# Altium schematic sheet Plumo-2D.SchDoc
size C; CompanyName: Afero; DrawnBy: SR/RSB; Organization: Afero, Inc.; Revision: PVT
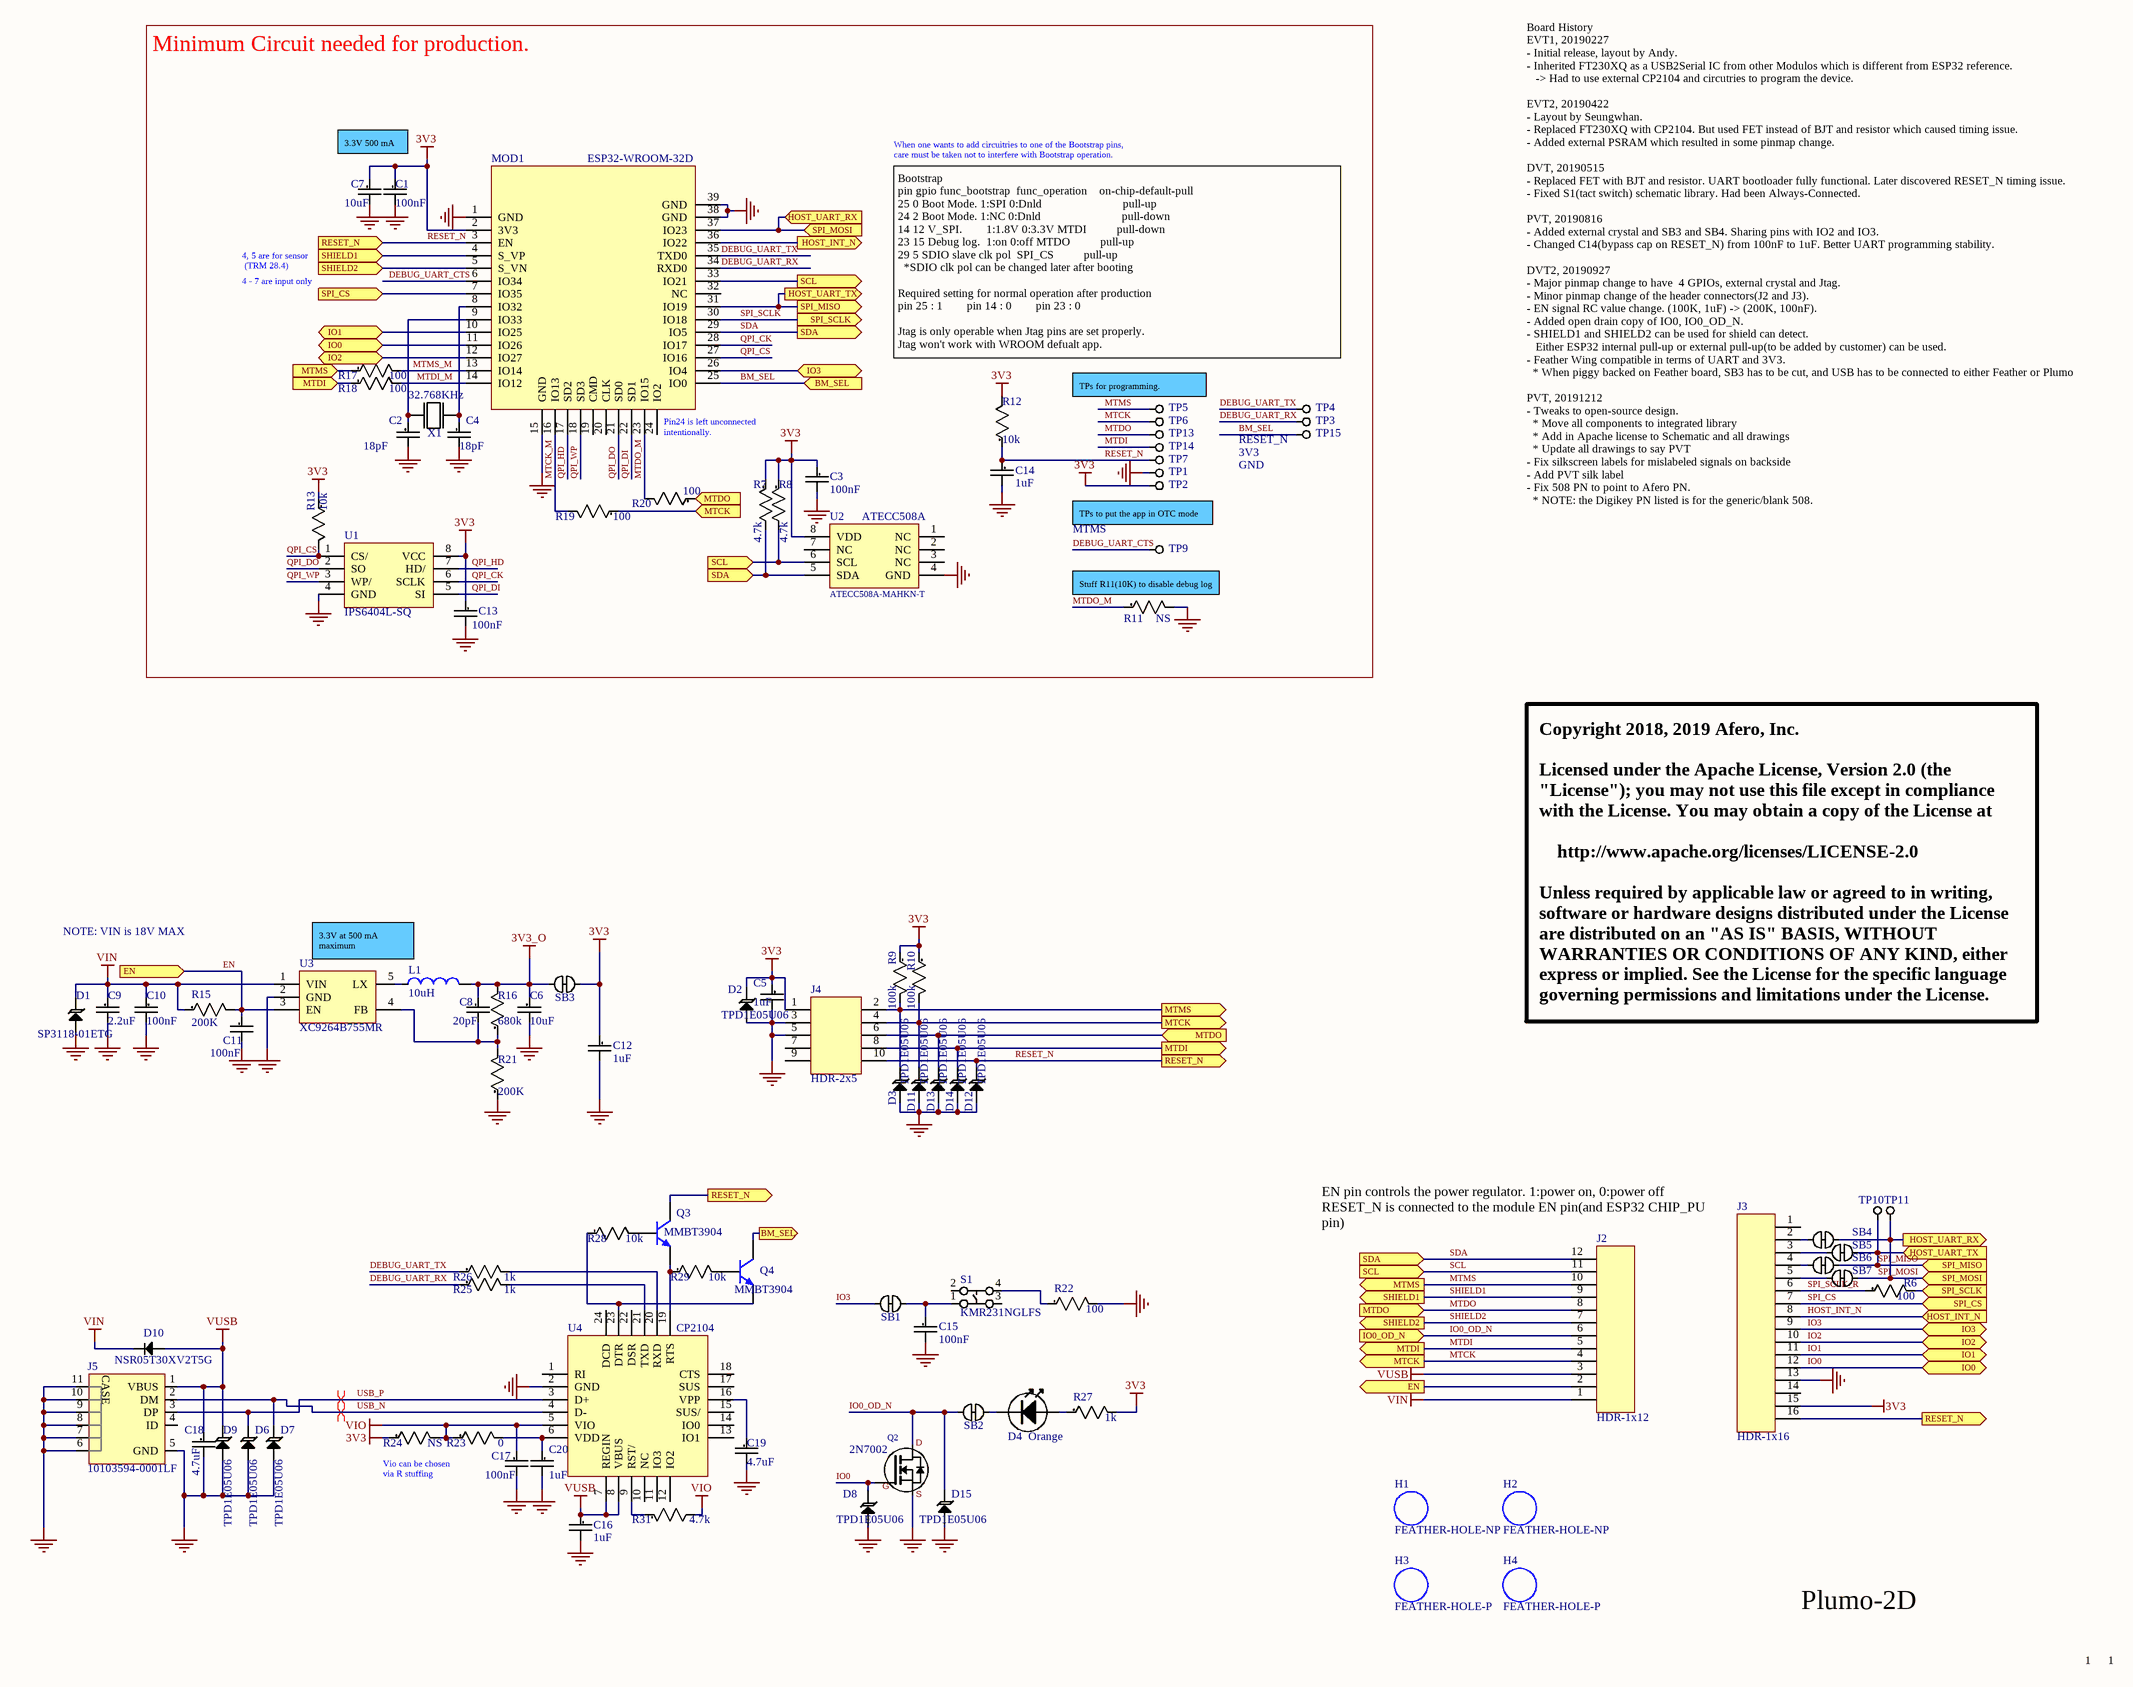
[diagram p0: Plumo-2D.SchDoc]

## Parts
C1  100nF  [0402C-GENERIC]
C2  18pF  [0402C-GENERIC]
C3  100nF  [0402C-GENERIC]
C4  18pF  [0402C-GENERIC]
C5  1uF  [0402C-GENERIC]
C6  10uF  [0603C-GENERIC]
C7  10uF  [0603C-GENERIC]
C8  20pF  [0402C-GENERIC]
C9  2.2uF  [0603C-GENERIC]
C10  100nF  [0402C-GENERIC]
C11  100nF  [0402C-GENERIC]
C12  1uF  [0402C-GENERIC]
C13  100nF  [0402C-GENERIC]
C14  1uF  [0402C-GENERIC]
C15  100nF  [0402C-GENERIC]
C16  1uF  [0402C-GENERIC]
C17  100nF  [0402C-GENERIC]
C18  4.7uF  [0603C-GENERIC]
C19  4.7uF  [0603C-GENERIC]
C20  1uF  [0402C-GENERIC]
D1  SP3118-01ETG  [SOD882]
D2  TPD1E05U06  [SON70P100X45-2N]
D3  TPD1E05U06  [SON70P100X45-2N]
D4  Orange  [0603LED]
D6  TPD1E05U06  [SON70P100X45-2N]
D7  TPD1E05U06  [SON70P100X45-2N]
D8  TPD1E05U06  [SON70P100X45-2N]
D9  TPD1E05U06  [SON70P100X45-2N]
D10  NSR05T30XV2T5G  [SOD-523]
D11  TPD1E05U06  [SON70P100X45-2N]
D12  TPD1E05U06  [SON70P100X45-2N]
D13  TPD1E05U06  [SON70P100X45-2N]
D14  TPD1E05U06  [SON70P100X45-2N]
D15  TPD1E05U06  [SON70P100X45-2N]
H1  FEATHER-HOLE-NP  [FEATHER-HOLE-NP]  (no BOM)
H2  FEATHER-HOLE-NP  [FEATHER-HOLE-NP]  (no BOM)
H3  FEATHER-HOLE-P  [FEATHER-HOLE-P]  (no BOM)
H4  FEATHER-HOLE-P  [FEATHER-HOLE-P]  (no BOM)
J2  HDR-1x12  [HDR-1X12]
J3  HDR-1x16  [HDR-1X16]
J4  HDR-2x5  [S9015E-05]
J5  10103594-0001LF  [10103594-0001LF]
L1  10uH  [ASPI-0315FS]
MOD1  ESP32-WROOM-32D  [ESP32-WROOM-32D]
Q2  2N7002  [SOT23]
Q3  MMBT3904  [sot23]
Q4  MMBT3904  [sot23]
R6  100  [0402R-GENERIC]
R7  4.7k  [0402R-GENERIC]
R8  4.7k  [0402R-GENERIC]
R9  100k  [0402R-GENERIC]
R10  100k  [0402R-GENERIC]
R11  NS  [0402R-GENERIC]  (no BOM)
R12  10k  [0402R-GENERIC]
R13  10k  [0402R-GENERIC]
R15  200K  [0402R-GENERIC]
R16  680k  [0402R-GENERIC]
R17  100  [0402R-GENERIC]
R18  100  [0402R-GENERIC]
R19  100  [0402R-GENERIC]
R20  100  [0402R-GENERIC]
R21  200K  [0402R-GENERIC]
R22  100  [0402R-GENERIC]
R23  0  [0402R-GENERIC]
R24  NS  [0402R-GENERIC]  (no BOM)
R25  1k  [0402R-GENERIC]
R26  1k  [0402R-GENERIC]
R27  1k  [0402R-GENERIC]
R28  10k  [0402R-GENERIC]
R29  10k  [0402R-GENERIC]
R31  4.7k  [0402R-GENERIC]
S1  KMR231NGLFS  [KMR231NGLFS]
SB1  Solderbridge  [SBNC]  (value not drawn)  (net tie, no BOM)
SB2  Solderbridge  [SBNC]  (value not drawn)  (net tie, no BOM)
SB3  Solderbridge  [SBNC]  (value not drawn)  (net tie, no BOM)
SB4  Solderbridge  [SBNC]  (value not drawn)  (net tie, no BOM)
SB5  Solderbridge  [SBNC]  (value not drawn)  (net tie, no BOM)
SB6  Solderbridge  [SBNC]  (value not drawn)  (net tie, no BOM)
SB7  Solderbridge  [SBNC]  (value not drawn)  (net tie, no BOM)
TP1  TP1MM  [TP1MM]  (value not drawn)  (no BOM)
TP2  TP1MM  [TP1MM]  (value not drawn)  (no BOM)
TP3  TP1MM  [TP1MM]  (value not drawn)  (no BOM)
TP4  TP1MM  [TP1MM]  (value not drawn)  (no BOM)
TP5  TP1MM  [TP1MM]  (value not drawn)  (no BOM)
TP6  TP1MM  [TP1MM]  (value not drawn)  (no BOM)
TP7  TP1MM  [TP1MM]  (value not drawn)  (no BOM)
TP9  TP1MM  [TP1MM]  (value not drawn)  (no BOM)
TP10  TP1MM  [TP1MM]  (value not drawn)  (no BOM)
TP11  TP1MM  [TP1MM]  (value not drawn)  (no BOM)
TP13  TP1MM  [TP1MM]  (value not drawn)  (no BOM)
TP14  TP1MM  [TP1MM]  (value not drawn)  (no BOM)
TP15  TP1MM  [TP1MM]  (value not drawn)  (no BOM)
U1  IPS6404L-SQ  [IPUS.PSRAM]
U2  ATECC508A  Manufacturer Part Number: ATECC508A-MAHKN-T  [SON50P300X60-8N]
U3  XC9264B755MR  [SOT95P275X130-5N]
U4  CP2104  [CP2104]
X1  32.768KHz  [ABS06]

## Blocks framed on the sheet
Minimum Circuit needed for production.: C1-C4 C7 C13 C14 MOD1 R7 R8 R11-R13 R17-R20 TP1-TP7 TP9 TP13-TP15 U1 U2 X1

## Ports
BM_SEL, EN, HOST_INT_N, HOST_UART_RX, HOST_UART_TX, IO0 (bidir), IO0_OD_N, IO1 (bidir), IO2 (bidir), IO3 (bidir), MTCK, MTDI, MTDO, MTMS, RESET_N, SCL, SDA, SHIELD1, SHIELD2, SPI_CS, SPI_MISO, SPI_MOSI, SPI_SCLK (in), SPI_SCLK (out)

## Nets
3V3: C1.1 C3.1 C5.1 C7.1 C12.1 C13.1 D2.1(I/O) J3.15 J4.1 MOD1.2(3V3) R7.1 R8.1 R9.1 R10.1 R12.2 R13.1 R24.1 R27.2 SB3.1 TP2.1 U1.8(VCC) U2.8(VDD)
3V3_O: C6.1 C8.1 L1.2 R16.2 SB3.2
GND: C1.2 C2.2 C3.2 C4.2 C5.2 C6.2 C7.2 C9.2 C10.2 C11.2 C12.2 C13.2 C14.2 C15.2 C16.2 C17.2 C18.2 C19.2 C20.2 D1.2(GND) D2.2(GND) D3.2(GND) D6.2(GND) D7.2(GND) D8.2(GND) D9.2(GND) D11.2(GND) D12.2(GND) D13.2(GND) D14.2(GND) D15.2(GND) J3.13 J4.3 J4.5 J5.5(GND) J5.6(CASE) J5.7(CASE) J5.8(CASE) J5.9(CASE) J5.10(CASE) J5.11(CASE) MOD1.1(GND) MOD1.15(GND) MOD1.38(GND) MOD1.39(GND) Q2.2(S) R11.2 R21.1 R22.2 TP1.1 U1.4(GND) U2.4(GND) U3.2(GND) U4.2(GND)
VIN: C9.1 C10.1 D1.1(I/O) D10.1(I/O) J2.1 R15.1 U3.1(VIN)
VIO: C17.1 R23.1 R24.2 R31.2 U4.5(VIO)
VUSB: C16.1 C18.1 D9.1(I/O) D10.2(GND) J2.3 J5.1(VBUS) U4.7(REGIN) U4.8(VBUS)
BM_SEL: MOD1.25(IO0) Q4.3(C) TP15.1 ; port BM_SEL
DEBUG_UART_CTS: MOD1.6(IO34) TP9.1
DEBUG_UART_RX: MOD1.34(RXD0) R25.1 TP3.1
DEBUG_UART_TX: MOD1.35(TXD0) R26.1 TP4.1
EN: C11.1 J2.2 R15.2 U3.3(EN) ; port EN
HOST_INT_N: J3.8 MOD1.36(IO22) ; port HOST_INT_N
IO0: D8.1(I/O) J3.12 MOD1.11(IO26) Q2.1(G) ; port IO0
IO0_OD_N: D15.1(I/O) J2.6 Q2.3(D) SB2.1 ; port IO0_OD_N
IO1: J3.11 MOD1.10(IO25) ; port IO1
IO2: J3.10 MOD1.12(IO27) ; port IO2
IO3: J3.9 MOD1.26(IO4) SB1.1 ; port IO3
MTCK: D11.1(I/O) J2.4 J4.4 R10.2 R19.1 TP6.1 ; port MTCK
MTCK_M: MOD1.16(IO13) R19.2
MTDI: D14.1(I/O) J2.5 J4.8 R18.1 TP14.1 ; port MTDI
MTDI_M: MOD1.14(IO12) R18.2
MTDO: D13.1(I/O) J2.8 J4.6 R20.1 TP13.1 ; port MTDO
MTDO_M: MOD1.23(IO15) R11.1 R20.2
MTMS: D3.1(I/O) J2.10 J4.2 R9.2 R17.1 TP5.1 ; port MTMS
MTMS_M: MOD1.13(IO14) R17.2
QPI_CK: MOD1.28(IO17) U1.6(SCLK)
QPI_CS: MOD1.27(IO16) R13.2 U1.1(CS/)
QPI_DI: MOD1.22(SD1) U1.5(SI)
QPI_DO: MOD1.21(SD0) U1.2(SO)
QPI_HD: MOD1.17(SD2) U1.7(HD/)
QPI_WP: MOD1.18(SD3) U1.3(WP/)
RESET_N: C14.1 D12.1(I/O) J3.16 J4.10 MOD1.3(EN) Q3.3(C) R12.1 TP7.1 ; port RESET_N
SCL: J2.11 MOD1.33(IO21) R8.2 U2.6(SCL) ; port SCL
SDA: J2.12 MOD1.29(IO5) R7.2 U2.5(SDA) ; port SDA
SHIELD1: J2.9 MOD1.4(S_VP) ; port SHIELD1
SHIELD2: J2.7 MOD1.5(S_VN) ; port SHIELD2
SPI_CS: J3.7 MOD1.7(IO35) ; port SPI_CS
SPI_MISO: MOD1.31(IO19) SB5.2 SB6.2 TP10.1 ; port SPI_MISO, port HOST_UART_TX
SPI_MOSI: MOD1.37(IO23) SB4.2 SB7.2 TP11.1 ; port SPI_MOSI, port HOST_UART_RX
SPI_SCLK: MOD1.30(IO18) R6.2 ; port SPI_SCLK
SPI_SCLK_R: J3.6 R6.1
USB_N: D7.1(I/O) J5.2(DM) U4.4(D-)
USB_P: D6.1(I/O) J5.3(DP) U4.3(D+)
NetC2_1: C2.1 MOD1.9(IO33) X1.2
NetC4_1: C4.1 MOD1.8(IO32) X1.1
NetC8_2: C8.2 R16.1 R21.2 U3.4(FB)
NetC15_1: C15.1 S1.1 SB1.2
NetC19_1: C19.1 U4.16(VPP)
NetC20_1: C20.1 R23.2 U4.6(VDD)
NetD4_A: D4.A R27.1
NetD4_K: D4.K SB2.2
NetJ3_2: J3.2 SB4.1
NetJ3_3: J3.3 SB5.1
NetJ3_4: J3.4 SB6.1
NetJ3_5: J3.5 SB7.1
NetL1_1: L1.1 U3.5(LX)
NetQ3_1: Q3.1(B) R28.2
NetQ3_2: Q3.2(E) R29.1 U4.19(RTS)
NetQ4_1: Q4.1(B) R29.2
NetQ4_2: Q4.2(E) R28.1 U4.23(DTR)
NetR22_1: R22.1 S1.4
NetR25_2: R25.2 U4.21(TXD)
NetR26_2: R26.2 U4.20(RXD)
NetR31_1: R31.1 U4.9(RST/)

Not connected (* = marked no-connect by the designer): J3 1 14; J4 7 9; J5 4(ID); MOD1 19(CMD) 20(CLK) 24(IO2) 32(NC); S1 2 3; U2 1(NC) 2(NC) 3(NC) 7(NC); U4 1(RI) 10(NC) 11(IO3) 12(IO2) 13(IO1) 14(IO0) 15(SUS/) 17(SUS) 18(CTS) 22(DSR) 24(DCD)

## Layout directives
differential pair: USB_N, USB_P

## Notes on the sheet
- 3.3V 500 mA
- When one wants to add circuitries to one of the Bootstrap pins,
  care must be taken not to interfere with Bootstrap operation.
- 4, 5 are for sensor
  (TRM 28.4)
- 4 - 7 are input only
- Bootstrap
  pin	gpio	func_bootstrap		func_operation    on-chip-default-pull
  25	0	Boot Mode. 1:SPI 0:Dnld	                          pull-up
  24	2	Boot Mode. 1:NC 0:Dnld	                          pull-down
  14	12	V_SPI.        1:1.8V 0:3.3V	MTDI	         pull-down
  23	15	Debug log.  1:on 0:off	MTDO	         pull-up
  29	5	SDIO slave clk pol		SPI_CS	         pull-up
  *SDIO clk pol can be changed later after booting
  Required setting for normal operation after production
  pin 25 : 1        pin 14 : 0        pin 23 : 0
  Jtag is only operable when Jtag pins are set properly.
  Jtag won't work with WROOM defualt app.
- (near TP5) TPs for programming.
- (near MOD1) Pin24 is left unconnected intentionally.
- RESET_N
- 3V3
- GND
- TPs to put the app in OTC mode
- MTMS
- Stuff R11(10K) to disable debug log
- Board History
  EVT1, 20190227
  - Initial release, layout by Andy.
  - Inherited FT230XQ as a USB2Serial IC from other Modulos which is different from ESP32 reference.
  -> Had to use external CP2104 and circutries to program the device.
  EVT2, 20190422
  - Layout by Seungwhan.
  - Replaced FT230XQ with CP2104. But used FET instead of BJT and resistor which caused timing issue.
  - Added external PSRAM which resulted in some pinmap change.
  DVT, 20190515
  - Replaced FET with BJT and resistor. UART bootloader fully functional. Later discovered RESET_N timing issue.
  - Fixed S1(tact switch) schematic library. Had been Always-Connected.
  PVT, 20190816
  - Added external crystal and SB3 and SB4. Sharing pins with IO2 and IO3.
  - Changed C14(bypass cap on RESET_N) from 100nF to 1uF. Better UART programming stability.
  DVT2, 20190927
  - Major pinmap change to have  4 GPIOs, external crystal and Jtag.
  - Minor pinmap change of the header connectors(J2 and J3).
  - EN signal RC value change. (100K, 1uF) -> (200K, 100nF).
  - Added open drain copy of IO0, IO0_OD_N.
  - SHIELD1 and SHIELD2 can be used for shield can detect.
  Either ESP32 internal pull-up or external pull-up(to be added by customer) can be used.
  - Feather Wing compatible in terms of UART and 3V3.
  * When piggy backed on Feather board, SB3 has to be cut, and USB has to be connected to either Feather or Plumo
  PVT, 20191212
  - Tweaks to open-source design.
  * Move all components to integrated library
  * Add in Apache license to Schematic and all drawings
  * Update all drawings to say PVT
  - Fix silkscreen labels for mislabeled signals on backside
  - Add PVT silk label
  - Fix 508 PN to point to Afero PN.
  * NOTE: the Digikey PN listed is for the generic/blank 508.
- NOTE: VIN is 18V MAX
- 3.3V at 500 mA maximum
- Copyright 2018, 2019 Afero, Inc.
  Licensed under the Apache License, Version 2.0 (the "License"); you may not use this file except in compliance with the License. You may obtain a copy of the License at
  http://www.apache.org/licenses/LICENSE-2.0
  Unless required by applicable law or agreed to in writing, software or hardware designs distributed under the License are distributed on an "AS IS" BASIS, WITHOUT WARRANTIES OR CONDITIONS OF ANY KIND, either express or implied. See the License for the specific language governing permissions and limitations under the License.
- (near J2) EN pin controls the power regulator. 1:power on, 0:power off
  RESET_N is connected to the module EN pin(and ESP32 CHIP_PU pin)
  Holding RESET_N low will put the module in reset state.
- Vio can be chosen
  via R stuffing
- Plumo-2D
- 1

## Library data of the parts
C1 C3 C10 C11 C13 C15 C17 = 0402C-100n: Capacitor 100nF X5R 50V 10% 0402; Manufacturer: Murata; Manufacturer Part Number: GRM155R61H104KE19D; item_number: E-CAP-00090-00; Supplier 1: Mouser; Stock 1: 727844; Pricing 1: 1=0.1, 10=0.068, 50=0.068, 100=0.03, 1000=0.017, 10000=0.011 (USD); Mount: Surface Mount; Case/Package: 0402; Case Code (Metric): 1005; Case Code (Imperial): 0402; Min Operating Temperature: -55°C; Max Operating Temperature: 85°C; Packaging: Tape and Reel; Capacitance: 100nF; Tolerance: 10%; Voltage Rating: 50V; Dielectric: X5R; Voltage: 50V; Voltage Rating (DC): 50V; Length: 1mm; Height: 0.5mm; Width: 0.02inch; Thickness: 0.022inch; Depth: 0.5mm; REACH SVHC: No SVHC; Lead Free: Lead Free; Supplier Part Number 1: 81-GRM155R61H104KE9D
C2 C4 = 0402C-18p: Capacitor, 18pF, 50V, 1%, C0G; Manufacturer: Murata; Manufacturer Part Number: GJM1555C1H180FB01D; item_number: E-CAP-00110-00; Mount: Surface Mount; Case/Package: 0402; Case Code (Metric): 1005; Case Code (Imperial): 0402; Min Operating Temperature: -55°C; Max Operating Temperature: 125°C; Capacitance: 18pF; Tolerance: 1%; Voltage Rating: 50V; Voltage Rating (DC): 50V; Packaging: Tape and Reel; Package Quantity: 10000; Dielectric: C0G; Termination: SMD/SMT; Length: 1mm; Height: 0.5mm; Width: 0.02inch; Thickness: 0.022inch; Depth: 0.5mm; Radiation Hardening: No; REACH SVHC: No SVHC; Lead Free: Lead Free
C5 C12 C14 C16 C20 = 0402C-1u: Capacitor 1uF X5R 6.3V 20% 0402; Manufacturer: SEM; Manufacturer Part Number: CL05A105KQ5NNNC; item_number: E-CAP-00020-00; Type: Chip Monolithic Ceramic Capacitor; Voltage Rating DC: 6.3 VDC; Capacitance - nF: 1000 nF; Value: 1u; Packaging: Cut Tape; Capacitance: 1uF; Tolerance: 20 %; Dielectric: X5R; Length: 1 mm; Height: 0.5 mm; Width: 0.5 mm; RoHS: RoHS Compliant; Category: Multilayer Ceramic Capacitors MLCC - SMD/SMT; Package / Case: 0402 (1005 metric); Product: General Type MLCCs; Series: GRM; Termination Style: SMD/SMT; Brand: SEM; Case Code - in: 0402; Case Code - mm: 1005; Maximum Operating Temperature: + 85 C; Minimum Operating Temperature: - 55 C; Standard Pack Qty: 50000; RoHS - Mouser: Y; Minimum Order Quantity: 1; Reeling: True
C6 C7 = 0603C-10u: Capacitor 10uF X5R 16V 20% 0603; Manufacturer: Murata; Manufacturer Part Number: GRM188R61C106MA73D; Value: 10u; Material: Ceramic; item_number: E-CAP-00100-00; Mount: Surface Mount; Case/Package: 0603; Weight: 0.000222oz; Case Code (Metric): 1608; Case Code (Imperial): 0603; Min Operating Temperature: -55°C; Max Operating Temperature: 85°C; Capacitance: 10uF; Tolerance: 20%; Packaging: Tape and Reel; Dielectric: X5R; Voltage Rating: 16V; Termination: SMD/SMT; Voltage Rating (DC): 16V; Package Quantity: 4000; Length: 1.6mm; Height: 1mm; Width: 0.8mm; Thickness: 0.037inch; Depth: 0.8mm; REACH SVHC: No SVHC; Lead Free: Lead Free
C8 = 0402C-20p: Capacitor 20pF C0G 50V 1% 0402; Manufacturer: Murata; Manufacturer Part Number: GJM1555C1H200FB01D; item_number: E-CAP-00107-00; Mount: Surface Mount; Case/Package: 0402; Case Code (Metric): 1005; Case Code (Imperial): 0402; Min Operating Temperature: -55°C; Max Operating Temperature: 125°C; Capacitance: 20pF; Tolerance: 1%; Voltage Rating: 50V; Voltage Rating (DC): 50V; Packaging: Tape and Reel; Package Quantity: 10000; Dielectric: C0G; Termination: SMD/SMT; Length: 1mm; Height: 0.5mm; Width: 0.02inch; Thickness: 0.022inch; Depth: 0.5mm; Radiation Hardening: No; REACH SVHC: No SVHC; Lead Free: Lead Free
C9 = 0603C-2u2: Capacitor 2.2uF X5R 25V 10% 0603; Manufacturer: Murata; Manufacturer Part Number: GRM188R61E225KA12D; Value: 2u2; Material: Ceramic; item_number: E-CAP-00108-00; Mount: Surface Mount; Case/Package: 0603; Weight: 0.000222oz; Case Code (Metric): 1608; Case Code (Imperial): 0603; Min Operating Temperature: -55°C; Max Operating Temperature: 85°C; Capacitance: 2.2uF; Tolerance: 10%; Packaging: Tape and Reel; Dielectric: X5R; Voltage Rating: 25V; Termination: SMD/SMT; Voltage Rating (DC): 25V; Package Quantity: 4000; Length: 1.6mm; Height: 0.9mm; Width: 0.8mm; Thickness: 0.037inch; Depth: 0.8mm; REACH SVHC: No SVHC; Lead Free: Lead Free
C18 C19 = 0603C-4u7: Capacitor 4.7uF X5R 10V 10% 0603; Manufacturer: Taiyo Yuden; Manufacturer Part Number: LMK107BJ475KA-T; Value: 4u7; Material: Ceramic; item_number: E-CAP-00066-00; Mount: Surface Mount; Case/Package: 0603; Weight: 0.000222oz; Case Code (Metric): 1608; Case Code (Imperial): 0603; Min Operating Temperature: -55°C; Max Operating Temperature: 85°C; Capacitance: 4.7uF; Tolerance: 10%; Packaging: Tape and Reel; Dielectric: X5R; Voltage Rating: 10V; Termination: SMD/SMT; Voltage Rating (DC): 10V; Package Quantity: 4000; Length: 1.6mm; Height: 0.9mm; Width: 0.8mm; Thickness: 0.035inch; Depth: 0.8mm; REACH SVHC: No SVHC; Lead Free: Lead Free
D1 = SP3118-01ETG: Diode TVS; Manufacturer: Littelfuse; Number of Channels: 1; Operating Supply Voltage: 18V; Capacitance: 0.3pF; Direction: Bidirectional; Clamping Voltage: 38V; Peak Pulse Power: 76W; Power Line Protection: Yes; Leakage Current: 50nA; Element Configuration: Single; Peak Pulse Current: 2A; item_number: E-DIO-00011-00; Manufacturer Part Number: SP3118-01ETG; Mount: Surface Mount; Number of Pins: 2; Min Operating Temperature: -40°C; Max Operating Temperature: 125°C; Package Quantity: 10000; Packaging: Tape and Reel; Number of Bidirectional Channels: 1; Min Breakdown Voltage: -; Reverse Standoff Voltage: 18V; Termination: SMD/SMT; Polarity: Bidirectional; Working Voltage: 18V; Max Power Dissipation: 76W; Length: 1mm; Radiation Hardening: No; Lead Free: Lead Free; REACH SVHC: No SVHC
D2 D3 D6-D9 D11-D15 = TPD1E05U06: Diode TVS; Manufacturer: Texas Instruments; Manufacturer Part Number: TPD1E05U06DPYR; Number of Channels: 1; Interface: LVDS,USB,Ethernet,HDMI,PCIe,SATA; Operating Supply Voltage: 5.5V; Capacitance: 0.5pF; Direction: Unidirectional; Min Breakdown Voltage: 6V; Clamping Voltage: 14V; Peak Pulse Power: 40W; Power Line Protection: Yes; Breakdown Voltage: 6.5V; Polarity: Bidirectional; Leakage Current: 10nA; Element Configuration: Single; Peak Pulse Current: 2.5A; item_number: E-DIO-00008-00; Supplier 1: Digi-Key; Supplier Part Number 1: 296-39341-1-ND; Stock 1: 161045; Pricing 1: 1=0.5, 10=0.372, 100=0.2107, 500=0.1395, 1000=0.107 (USD); Mount: Surface Mount; Number of Pins: 2; Min Operating Temperature: -40°C; Max Operating Temperature: 125°C; Package Quantity: 10000; Packaging: Tape and Reel; Number of Bidirectional Channels: 1; Reverse Standoff Voltage: 5.5V; Termination: SMD/SMT; Working Voltage: 5.5V; Max Power Dissipation: 40W; Length: 1.1mm; Radiation Hardening: No; Lead Free: Lead Free; REACH SVHC: No SVHC; ComponentLink1URL: https://datasheet.ciiva.com/12545/tpd1e05u06-224685-12545140.pdf; ComponentLink1Description: https://datasheet.ciiva.com/12545/tpd1e05u06-224685-12545140.pdf; ComponentLink2URL: https://datasheet.ciiva.com/26918/getdatasheetpartid-700473-26918022.pdf; ComponentLink2Description: https://datasheet.ciiva.com/26918/getdatasheetpartid-700473-26918022.pdf; ComponentLink3URL: https://datasheet.ciiva.com/6574/tpd1e05u06-6574667.pdf; ComponentLink3Description: https://datasheet.ciiva.com/6574/tpd1e05u06-6574667.pdf
D4 = LED_0603_O: LED Orange 0603; Manufacturer: Vishay Lite-On; Manufacturer Part Number: LTST-C190KAKT; Colour: Red,Orange; Lens Colour: Colorless; Forward Voltage: 2V; Test Current: 20mA; Forward Current: 30mA; Wavelength: 621nm; Luminous Intensity: 54mcd; Lens Style: Flat,Diffused,Colorless,Rectangular; Viewing Angle: 130°; Dominant Wavelength: 615nm; Lens Transparency: Clear; Number of Elements: 1; Power Dissipation: 75mW; Reverse Voltage: 5V; item_number: E-LED-00012-00; Supplier 1: Digi-Key; Supplier Part Number 1: 160-1433-1-ND; Stock 1: 60967; Pricing 1: 1=0.41, 10=0.296, 25=0.2268, 100=0.148, 250=0.1085, 500=0.0921, 1000=0.0757 (USD); Mount: Surface Mount; Case/Package: 0603; Number of Pins: 2; Case Code (Metric): 1608; Case Code (Imperial): 0603; Min Operating Temperature: -55°C; Max Operating Temperature: 85°C; Packaging: Tape and Reel; Package Quantity: 1; Illumination Colour: Orange; Number of LEDs: 1; Orientation: Top View; Length: 1.6mm; Height: 0.8mm; Width: 0.8mm; Depth: 1.6mm; Radiation Hardening: No; Lead Free: Lead Free; ComponentLink1URL: https://datasheet.ciiva.com/24120/ltst-c190kakt-267511-24120611.pdf; ComponentLink1Description: https://datasheet.ciiva.com/24120/ltst-c190kakt-267511-24120611.pdf; ComponentLink2URL: https://datasheet.ciiva.com/26937/getdatasheetpartid-257177-26937956.pdf; ComponentLink2Description: https://datasheet.ciiva.com/26937/getdatasheetpartid-257177-26937956.pdf; ComponentLink3URL: https://datasheet.ciiva.com/2110/ltst-c150-170-190kxkt-2110261.pdf; ComponentLink3Description: https://datasheet.ciiva.com/2110/ltst-c150-170-190kxkt-2110261.pdf; ComponentLink4URL: https://datasheet.ciiva.com/2110/ltst-c150-170-190kxkt-2110262.pdf; ComponentLink4Description: https://datasheet.ciiva.com/2110/ltst-c150-170-190kxkt-2110262.pdf; ComponentLink5URL: https://datasheet.ciiva.com/2110/ltst-c150-170-190kxkt-2110263.pdf; ComponentLink5Description: https://datasheet.ciiva.com/2110/ltst-c150-170-190kxkt-2110263.pdf
D10 = NSR05T30XV2T5G: Diode Schottky 30V 0.5A SOD523; Manufacturer: On Semiconductor; Number of Channels: 1; Direction: Unidirectional; Leakage Current: 170uA/30V; Element Configuration: Single; Peak Pulse Current: 1.5A; item_number: E-DIO-00012-00; Manufacturer Part Number: NSR05T30XV2T5G; Mount: Surface Mount; Number of Pins: 2; Min Operating Temperature: -55°C; Max Operating Temperature: 150°C; Package Quantity: 10000; Packaging: Tape and Reel; Max Reverse Voltage (DC): 30V; Termination: SMD/SMT; Length: 1.6mm; Radiation Hardening: No; Lead Free: Lead Free; REACH SVHC: No SVHC; Voltage Rating (DC): 30V; Package / Case: SOD523
H1 H2 = FEATHER-HOLE-NP: 0.09" Unplated Hole
H3 H4 = FEATHER-HOLE-P: 0.1" Plated Hole
J2 = HDR-1x12: 0.1" header 12 positions; Manufacturer Part Number: 22032121; Manufacturer: Molex; item_number: M-CON-00086-00
J3 = HDR-1x16: 0.1" header 16 positions; Manufacturer Part Number: 22032161; Manufacturer: Molex; item_number: M-CON-00087-00
J4 = HDR-2x5: .050 Male Header 2x5; Manufacturer Part Number: GRPB052VWVN-RC; item_number: M-CON-00016-00
J5 = 10103594-0001LF: Connector MICRO USB B; Manufacturer: Amphenol FCI; Gender: Receptacle; Voltage Rating: 100V; Current Rating: 1.8A; Connector Type: USB,Receptacle; Number of Ports: 1; Insulation Resistance: 1GR; Number of Contacts: 5; USB Standard: USB 2.0; Pitch: 0.65mm; item_number: M-CON-00011-00; Supplier 1: Digi-Key; Supplier Part Number 1: 609-4050-1-ND; Manufacturer Part Number: 10103594-0001LF; Stock 1: 103885; Pricing 1: 1=0.82, 10=0.721, 25=0.6788, 50=0.6504, 100=0.6221, 250=0.5655, 500=0.509 (USD); Mount: Surface Mount,Horizontal; Contact Plating: Gold; Contact Material: Copper,Copper Alloy; Number of Terminals: 5; Housing Material: Thermoplastic; Min Operating Temperature: -55°C; Max Operating Temperature: 85°C; Termination: Solder; Orientation: Right Angle; Packaging: Tape and Reel; Package Quantity: 1500; Max Voltage Rating (AC): 100V; Features: Shielded; Length: 8.04mm; Radiation Hardening: No; REACH SVHC: No SVHC; Lead Free: Lead Free; ComponentLink1URL: https://datasheet.ciiva.com/8015/10103594-8015248.pdf; ComponentLink1Description: https://datasheet.ciiva.com/8015/10103594-8015248.pdf; ComponentLink2URL: https://datasheet.ciiva.com/11731/0900766b80ed1ae4-11731328.pdf; ComponentLink2Description: https://datasheet.ciiva.com/11731/0900766b80ed1ae4-11731328.pdf; ComponentLink3URL: https://datasheet.ciiva.com/14618/70236822-14618885.pdf; ComponentLink3Description: https://datasheet.ciiva.com/14618/70236822-14618885.pdf; ComponentLink4URL: https://datasheet.ciiva.com/22654/1469075-22654519.pdf; ComponentLink4Description: https://datasheet.ciiva.com/22654/1469075-22654519.pdf; ComponentLink5URL: https://datasheet.ciiva.com/851/10103594-851115.pdf; ComponentLink5Description: https://datasheet.ciiva.com/851/10103594-851115.pdf; ComponentLink6URL: https://datasheet.ciiva.com/5726/10103594-5726971.pdf; ComponentLink6Description: https://datasheet.ciiva.com/5726/10103594-5726971.pdf; ComponentLink7URL: https://datasheet.ciiva.com/851/10103594-851116.pdf; ComponentLink7Description: https://datasheet.ciiva.com/851/10103594-851116.pdf; ComponentLink8URL: https://datasheet.ciiva.com/851/10103594-851117.pdf; ComponentLink8Description: https://datasheet.ciiva.com/851/10103594-851117.pdf
L1 = ASPI-0315FS-100M: Inductor 10uH 1.1A 0.22ohm 20% 3x3; Manufacturer: Abracon; item_number: E-IND-00043-00; Value: 10uH; Manufacturer Part Number: ASPI-0315FS-100M
MOD1 = ESP32-WROOM-32D: Module WIFI BLE ESP32-D0WD 4MB; Manufacturer: Espressif; Item_number: E-ICS-00097-00; Size: 25.5mm x 18mm; Manufacturer Part Number: ESP32-WROOM-32D
Q2 = Nch_MOSFET_2N7002: TR MOSFET N-CH 60V 115mA SOT23; Manufacturer: On Semiconductor; Commodity: FET; item_number: E-TRS-00003-00; Manufacturer Part Number: 2N7002; Value: 2N7002; Package / Case: SOT23
Q3 Q4 = MMBT3904: TR NPN BJT 200mA 40V; Manufacturer Part Number: MMBT3904LT1G; Manufacturer: On Semiconductor; item_number: E-TRS-00002-00; ComponentLink1Description: Manufacturer Link; ComponentLink1URL: http://www.fairchildsemi.com/; ComponentLink2Description: Datasheet; ComponentLink2URL: http://www.fairchildsemi.com/ds/2N%2F2N3904.pdf; Package/Case: SOT23
R6 R17-R20 R22 = 0402R-100R: Resistor 100R 50V 5% 0402; Manufacturer: Panasonic; Manufacturer Part Number: ERJ-2GEJ101X; Temperature Coefficient: 100ppm/°C; Power Rating: 100mW; item_number: E-RES-00008-00; Pricing 1: 1=0.1, 10=0.044, 100=0.0178, 1000=0.008, 2500=0.007, 5000=0.0058 (USD); Mount: Surface Mount; Case/Package: 0402; Weight: 2.3E-05oz; Case Code (Metric): 1005; Case Code (Imperial): 0402; Contact Plating: Tin; Min Operating Temperature: -55°C; Max Operating Temperature: 155°C; Resistance: 100; Tolerance: 5%; Packaging: Tape and Reel; Voltage Rating (DC): 50V; Voltage Rating: 50V; Termination: SMD/SMT; Package Quantity: 10; Composition: Thick Film; Number of Terminations: 2; Military Standard: Not; Max Power Dissipation: 100mW; Features: Automotive AEC-Q200; Working Voltage: 50V; Length: 1mm; Height: 0.35mm; Width: 0.02inch; Depth: 0.5mm; Radiation Hardening: No; REACH SVHC: Unknown; Lead Free: Lead Free
R7 R8 R31 = 0402R-4k7: Resistor 4.7K 50V 5% 0402; Manufacturer: Panasonic; Manufacturer Part Number: ERJ-2GEJ472X; Temperature Coefficient: 200ppm/°C; Power Rating: 100mW; item_number: E-RES-00039-00; Supplier 1: Digi-Key; Supplier Part Number 1: P4.7KJCT-ND; Stock 1: 10404054; Pricing 1: 1=0.1, 10=0.038, 100=0.0154, 1000=0.0069, 2500=0.006, 5000=0.005 (USD); Mount: Surface Mount; Case/Package: 0402; Case Code (Imperial): 0402; Case Code (Metric): 1005; Contact Plating: Tin; Min Operating Temperature: -55°C; Max Operating Temperature: 155°C; Resistance: 4.7k; Tolerance: 5%; Voltage Rating: 50V; Packaging: Cut Tape; Termination: SMD/SMT; Military Standard: Not; Package Quantity: 1; Composition: Thick Film; Number of Terminations: 2; Max Power Dissipation: 100mW; Voltage Rating (DC): 50V; Features: Automotive AEC-Q200; Length: 1mm; Height: 0.35mm; Width: 0.5mm; Depth: 0.5mm; Radiation Hardening: No; REACH SVHC: No SVHC; Lead Free: Lead Free; ComponentLink1URL: https://datasheet.ciiva.com/11821/0900766b80f806dd-11821328.pdf; ComponentLink1Description: https://datasheet.ciiva.com/11821/0900766b80f806dd-11821328.pdf; ComponentLink2URL: https://datasheet.ciiva.com/16758/70260739-16758341.pdf; ComponentLink2Description: https://datasheet.ciiva.com/16758/70260739-16758341.pdf; ComponentLink3URL: https://datasheet.ciiva.com/16770/70260739-16770309.pdf; ComponentLink3Description: https://datasheet.ciiva.com/16770/70260739-16770309.pdf; ComponentLink4URL: https://datasheet.ciiva.com/28514/1678796-28514168.pdf; ComponentLink4Description: https://datasheet.ciiva.com/28514/1678796-28514168.pdf; ComponentLink5URL: https://datasheet.ciiva.com/17213/aoa0000ce1-17213178.pdf; ComponentLink5Description: https://datasheet.ciiva.com/17213/aoa0000ce1-17213178.pdf; ComponentLink6URL: https://datasheet.ciiva.com/16523/aoa0000ce1-16523499.pdf; ComponentLink6Description: https://datasheet.ciiva.com/16523/aoa0000ce1-16523499.pdf; ComponentLink7URL: https://datasheet.ciiva.com/46377/1678796-46377565.pdf; ComponentLink7Description: https://datasheet.ciiva.com/46377/1678796-46377565.pdf
R9 R10 = 0402R-100k: Resistor 100K 50V 5% 0402; Manufacturer: Panasonic; Manufacturer Part Number: ERJ-2GEJ104X; Power Rating: 100mW; Temperature Coefficient: 200ppm/°C; item_number: E-RES-00012-00; Supplier 1: Digi-Key; Supplier Part Number 1: P100KJCT-ND; Stock 1: 10583442; Pricing 1: 1=0.1, 10=0.038, 100=0.0154, 1000=0.0069, 2500=0.006, 5000=0.005 (USD); Mount: Surface Mount; Case/Package: 0402; Case Code (Imperial): 0402; Case Code (Metric): 1005; Contact Plating: Tin; Min Operating Temperature: -55°C; Max Operating Temperature: 155°C; Resistance: 100k; Tolerance: 5%; Packaging: Tape and Reel; Termination: SMD/SMT; Package Quantity: 1; Voltage Rating: 50V; Composition: Thick Film; Military Standard: Not; Number of Terminations: 2; Max Power Dissipation: 100mW; Features: Automotive AEC-Q200; Length: 1mm; Height: 0.35mm; Depth: 0.5mm; Width: 0.02inch; Radiation Hardening: No; REACH SVHC: No SVHC; ComponentLink1URL: https://datasheet.ciiva.com/11821/0900766b80f806dd-11821174.pdf; ComponentLink1Description: https://datasheet.ciiva.com/11821/0900766b80f806dd-11821174.pdf; ComponentLink2URL: https://datasheet.ciiva.com/22758/1500035-22758198.pdf; ComponentLink2Description: https://datasheet.ciiva.com/22758/1500035-22758198.pdf; ComponentLink3URL: https://datasheet.ciiva.com/34303/1986799-34303543.pdf; ComponentLink3Description: https://datasheet.ciiva.com/34303/1986799-34303543.pdf; ComponentLink4URL: https://datasheet.ciiva.com/24023/aoa0000ce1-37422-24023480.pdf; ComponentLink4Description: https://datasheet.ciiva.com/24023/aoa0000ce1-37422-24023480.pdf; ComponentLink5URL: https://datasheet.ciiva.com/16777/70260739-16777321.pdf; ComponentLink5Description: https://datasheet.ciiva.com/16777/70260739-16777321.pdf; ComponentLink6URL: https://datasheet.ciiva.com/16759/70260739-16759692.pdf; ComponentLink6Description: https://datasheet.ciiva.com/16759/70260739-16759692.pdf; ComponentLink7URL: https://datasheet.ciiva.com/48531/aoa0000ce1-48531084.pdf; ComponentLink7Description: https://datasheet.ciiva.com/48531/aoa0000ce1-48531084.pdf; ComponentLink8URL: https://datasheet.ciiva.com/9186/aoa0000ce1-9186685.pdf; ComponentLink8Description: https://datasheet.ciiva.com/9186/aoa0000ce1-9186685.pdf; ComponentLink9URL: https://datasheet.ciiva.com/30204/4aoa0000ce1-30204557.pdf; ComponentLink9Description: https://datasheet.ciiva.com/30204/4aoa0000ce1-30204557.pdf; Voltage Rating (DC): 50V; Lead Free: Lead Free; ComponentLink10URL: https://datasheet.ciiva.com/46389/1500035-46389645.pdf; ComponentLink10Description: https://datasheet.ciiva.com/46389/1500035-46389645.pdf
R11 R24 = 0402R-NS: Resistor 0402 No Stuff; Tolerance: 1%; Case/Package: 0402; Case Code (Imperial): 0402; Case Code (Metric): 1005; Contact Plating: Tin,Matte; Min Operating Temperature: -55°C; Max Operating Temperature: 155°C; Termination: SMD/SMT; Composition: Thick Film; Length: 1mm; Height: 0.35mm; Width: 0.5mm; Radiation Hardening: No; Lead Free: Lead Free; Value: NS
R12 R13 R28 R29 = 0402R-10k: Resistor 10K 50V 5% 0402; Manufacturer: Vishay Dale; Manufacturer Part Number: CRCW040210K0JNED; Power Rating: 63mW; Temperature Coefficient: 200ppm/°C; item_number: E-RES-00001-00; Supplier 1: Digi-Key; Supplier Part Number 1: 541-10KJCT-ND; Stock 1: 0; Pricing 1: 1=0.1, 10=0.031, 100=0.0125, 1000=0.0056, 2500=0.0049, 5000=0.004 (USD); Mount: Surface Mount; Case/Package: 0402; Weight: 2.3E-05oz; Case Code (Imperial): 0402; Case Code (Metric): 1005; Contact Plating: Tin; Min Operating Temperature: -55°C; Max Operating Temperature: 155°C; Resistance: 10k; Tolerance: 5%; Packaging: Tape and Reel; Termination: SMD/SMT; Package Quantity: 1; Voltage Rating: 50V; Composition: Thick Film; Military Standard: Not; Number of Terminations: 2; Max Power Dissipation: 63mW; Features: Automotive AEC-Q200; Length: 1mm; Height: 0.016inch; Depth: 0.5mm; Width: 0.5mm; Radiation Hardening: No; REACH SVHC: Unknown; ComponentLink1URL: https://datasheet.ciiva.com/2461/dcrcwe3-2461974.pdf; ComponentLink1Description: https://datasheet.ciiva.com/2461/dcrcwe3-2461974.pdf; ComponentLink2URL: https://datasheet.ciiva.com/2461/dcrcwe3-2461975.pdf; ComponentLink2Description: https://datasheet.ciiva.com/2461/dcrcwe3-2461975.pdf; ComponentLink3URL: https://datasheet.ciiva.com/2461/dcrcwe3-2461976.pdf; ComponentLink3Description: https://datasheet.ciiva.com/2461/dcrcwe3-2461976.pdf; ComponentLink4URL: https://datasheet.ciiva.com/7743/dcrcwe3-7743416.pdf; ComponentLink4Description: https://datasheet.ciiva.com/7743/dcrcwe3-7743416.pdf; ComponentLink5URL: https://datasheet.ciiva.com/16771/70201119-16771096.pdf; ComponentLink5Description: https://datasheet.ciiva.com/16771/70201119-16771096.pdf; ComponentLink6URL: https://datasheet.ciiva.com/7743/dcrcwe3-7743417.pdf; ComponentLink6Description: https://datasheet.ciiva.com/7743/dcrcwe3-7743417.pdf; ComponentLink7URL: https://datasheet.ciiva.com/16761/70201119-16761947.pdf; ComponentLink7Description: https://datasheet.ciiva.com/16761/70201119-16761947.pdf; ComponentLink8URL: https://datasheet.ciiva.com/3255/dcrcwe3-3255964.pdf; ComponentLink8Description: https://datasheet.ciiva.com/3255/dcrcwe3-3255964.pdf; ComponentLink9URL: https://datasheet.ciiva.com/3255/dcrcwe3-3255965.pdf; ComponentLink9Description: https://datasheet.ciiva.com/3255/dcrcwe3-3255965.pdf
R15 R21 = 0402R-200k: Resistor 200K 50V 1% 0402; Manufacturer: Panasonic; Manufacturer Part Number: ERJ-2RKF2003X; Power Rating: 100mW; Temperature Coefficient: 200ppm/°C; item_number: E-RES-00054-00; Mount: Surface Mount; Case/Package: 0402; Case Code (Metric): 1005; Case Code (Imperial): 0402; Contact Plating: Tin; Min Operating Temperature: -55°C; Max Operating Temperature: 155°C; Resistance: 200K; Tolerance: 1%; Packaging: Tape and Reel; Termination: SMD/SMT; Package Quantity: 1; Voltage Rating: 50V; Composition: Thick Film; Max Power Dissipation: 100mW; Number of Terminations: 2; Military Standard: Not; Voltage Rating (DC): 50V; Features: Automotive AEC-Q200; Length: 1mm; Height: 0.35mm; Depth: 0.5mm; Width: 0.02inch; Radiation Hardening: No; REACH SVHC: No SVHC; Lead Free: Lead Free
R16 = 0402R-680k: Resistor 680K 50V 5% 0402; Manufacturer: Panasonic; Manufacturer Part Number: ERJ-2GEJ684X; Power Rating: 100mW; Temperature Coefficient: 200ppm/°C; item_number: E-RES-00093-00; Supplier 1: Digi-Key; Supplier Part Number 1: P100KJCT-ND; Stock 1: 10583442; Mount: Surface Mount; Case/Package: 0402; Case Code (Metric): 1005; Case Code (Imperial): 0402; Contact Plating: Tin; Min Operating Temperature: -55°C; Max Operating Temperature: 155°C; Resistance: 680k; Tolerance: 5%; Packaging: Tape and Reel; Termination: SMD/SMT; Package Quantity: 1; Voltage Rating: 50V; Composition: Thick Film; Max Power Dissipation: 100mW; Number of Terminations: 2; Military Standard: Not; Voltage Rating (DC): 50V; Features: Automotive AEC-Q200; Length: 1mm; Height: 0.35mm; Depth: 0.5mm; Width: 0.02inch; Radiation Hardening: No; REACH SVHC: No SVHC; Lead Free: Lead Free
R23 = 0402R-0R0: Resistor 0R 50V 1% 0402; Manufacturer: Yageo; Manufacturer Part Number: RC0402FR-070RL; Resistance: 0mR; Power Rating: 62.5mW; Temperature Coefficient: 200ppm/°C; item_number: E-RES-00006-00; Supplier 1: Mouser; Supplier Part Number 1: 603-RC0402FR-070RL; Stock 1: 240535; Pricing 1: 1=0.1, 10=0.01, 50=0.01, 100=0.003, 1000=0.002, 10000=0.002 (USD); Case/Package: 0402; Contact Plating: Tin,Matte; Case Code (Imperial): 0402; Case Code (Metric): 1005; Min Operating Temperature: -55°C; Max Operating Temperature: 155°C; Composition: Thick Film; Tolerance: 1%; Packaging: Tape and Reel; Voltage Rating: 50V; Termination: SMD/SMT; Length: 1mm; Height: 0.35mm; Width: 0.5mm; Radiation Hardening: No; Lead Free: Lead Free; ComponentLink1URL: https://datasheet.ciiva.com/8896/pyu-rc0402-51-rohs-l-6-8896149.pdf; ComponentLink1Description: https://datasheet.ciiva.com/8896/pyu-rc0402-51-rohs-l-6-8896149.pdf; ComponentLink2URL: https://datasheet.ciiva.com/16790/pyu-rc0402-51-rohs-l-6-r-16790444.pdf; ComponentLink2Description: https://datasheet.ciiva.com/16790/pyu-rc0402-51-rohs-l-6-r-16790444.pdf; ComponentLink3URL: https://datasheet.ciiva.com/28419/pyu-rc0402-51-rohs-l-6-28419661.pdf; ComponentLink3Description: https://datasheet.ciiva.com/28419/pyu-rc0402-51-rohs-l-6-28419661.pdf; ComponentLink4URL: https://datasheet.ciiva.com/16869/pyu-rc0402-51-rohs-l-6-16869518.pdf; ComponentLink4Description: https://datasheet.ciiva.com/16869/pyu-rc0402-51-rohs-l-6-16869518.pdf; Value: 0
R25 R26 = 0402R-1k: Resistor 1K 50V 5% 0402; Manufacturer: Panasonic; Manufacturer Part Number: ERJ-2GEJ102X; Temperature Coefficient: 50ppm/°C; Power Rating: 100mW; item_number: E-RES-00002-00; Pricing 1: 1=0.1, 10=0.076, 100=0.029, 1000=0.0128, 2500=0.011, 5000=0.0099 (USD); Case/Package: 0402; Case Code (Metric): 1005; Case Code (Imperial): 0402; Contact Plating: Tin,Lead,Matte; Min Operating Temperature: -55°C; Max Operating Temperature: 125°C; Packaging: Tape and Reel; Resistance: 1k; Tolerance: 5%; Voltage Rating: 50V; Composition: Thin Film; Termination: SMD/SMT; Number of Terminations: 2; Max Power Dissipation: 100mW; Package Quantity: 10000; Military Standard: Not; Voltage Rating (DC): 50V; Length: 1mm; Height: 0.014inch; Width: 0.02inch; Depth: 0.5mm; Radiation Hardening: No; Lead Free: Lead Free
R27 = 0402R-1k: Resistor 1K 50V 5% 0402; Manufacturer: Panasonic; Manufacturer Part Number: ERJ-2GEJ102X; Power Rating: 100mW; Temperature Coefficient: 50ppm/°C; item_number: E-RES-00002-00; Pricing 1: 1=0.1, 10=0.076, 100=0.029, 1000=0.0128, 2500=0.011, 5000=0.0099 (USD); Case/Package: 0402; Case Code (Metric): 1005; Case Code (Imperial): 0402; Contact Plating: Tin,Lead,Matte; Min Operating Temperature: -55°C; Max Operating Temperature: 125°C; Resistance: 1k; Tolerance: 5%; Packaging: Tape and Reel; Voltage Rating: 50V; Composition: Thin Film; Voltage Rating (DC): 50V; Number of Terminations: 2; Termination: SMD/SMT; Package Quantity: 10000; Military Standard: Not; Max Power Dissipation: 100mW; Length: 1mm; Height: 0.014inch; Width: 0.02inch; Depth: 0.5mm; Lead Free: Lead Free; Radiation Hardening: No
S1 = KMR231NGLFS: SMD Tact Switch; Manufacturer: ITT C&K; item_number: E-SWI-00022; Mechanical Life: 150000Cycles; Throw Configuration: SPST; Operating Force: 3N; Max Current Rating: 50mA; Max Voltage Rating (DC): 32V; Power Rating: 1W; Illumination Type: Non-Illuminated; Switch Travel: 0.25mm; Switch Function: Off-Mom; Actuator Type: Standard; Actuator Length: 0.5mm; Supplier 1: Digi-Key; Supplier Part Number 1: CKN10246CT-ND; Manufacturer Part Number: KMR231NGLFS; Stock 1: 45821; Pricing 1: 1=0.52, 10=0.499, 25=0.4896, 50=0.4712, 100=0.4065, 250=0.3696, 500=0.3511, 1000=0.2772 (USD); Mount: Surface Mount; Case/Package: SMD/SMT; Contact Material: Silver; Contact Plating: Silver; Min Operating Temperature: -40°C; Max Operating Temperature: 85°C; Termination: Gull Wing; Packaging: Tape and Reel; Current Rating: 50mA; Package Quantity: 7000; Voltage Rating (DC): 32V; Orientation: Straight; Length: 2.8mm; Depth: 2.8mm; Radiation Hardening: No; ComponentLink1URL: https://www.ckswitches.com/media/1479/kmr2.pdf; ComponentLink1Description: https://www.ckswitches.com/media/1479/kmr2.pdf; ComponentLink2URL: http://www.ck-components.com/14414/kmr2_9aug12.pdf/; ComponentLink2Description: http://www.ck-components.com/14414/kmr2_9aug12.pdf/
SB1-SB7 = SBNC: Solderbridge, Normally Closed; Part Number: Solderbridge Shorted; Artikkelnr Noca: N.A.; Manufacturer: *; Manufacturer Part Number: *; Datasheet: *; LatestRevisionDate: 2012-08-07; Pin Count: 2; Value: Solderbridge; Note: *; Supplier: *; Supplier part number: *; Footprint Doc: Solderbridge_Shorted; Artikkelnr Simpro: N.A.
TP1-TP7 TP9-TP11 TP13-TP15 = TP1MM: 1mm Test Point; item_number: =item_name
U1 = IPS6404L-SQ: Memory SPI/QPI PSRAM 8MB SOIC8 150mil; Manufacturer: IPUS; Manufacturer Part Number: IPS6404L-SQ-SPN; item_number: E-ICS-00099-00; Package / Case: 8 SOIC 150mil
U2 = ATECC508A: Afero Custom CryptoAuthentication Device; Manufacturer: Microchip / Atmel; item_number: E-ICS-00072-00; Supplier 1: Digi-Key; Supplier Part Number 1: ATECC508A-MAHDA-TCT-ND; Stock 1: 4638; Pricing 1: 1=0.35, 25=0.32, 100=0.29 (USD); Mount: Surface Mount; Min Operating Temperature: -40°C; Max Operating Temperature: 85°C; Packaging: Tape and Reel
U3 = XC9264B755MR: Voltage Regulator 0.5A 500KHz Buck; Manufacturer: Torex; item_number: E-ICS-00096-00; Manufacturer Part Number: XC9264B755MR; Package / Case: SOT25
U4 = CP2104: USB to UART Bridge; Manufacturer Part Number: CP2104-F03-GM; Manufacturer: SiLabs; item_number: E-ICS-00098-00
X1 = ABS06-32.768KHZ-T: Crystal, 32.768kHz ±20ppm; Manufacturer: Abracon; Load Capacitance: 12.5pF; ESR (Equivalent Series Resistance): 90kR; Insulation Resistance: 500MR; item_number: E-XTL-00012-00; Supplier 1: Digi-Key; Supplier Part Number 1: 535-10104-1-ND; Manufacturer Part Number: ABS06-32.768KHZ-T; Stock 1: 65982; Pricing 1: 1=1.34, 10=1.277, 50=1.2474, 100=1.0692, 500=1.0395, 1000=0.8762 (USD); Mount: Surface Mount; Case/Package: SMD/SMT; Number of Pins: 2; Min Operating Temperature: -40°C; Max Operating Temperature: 85°C; Frequency: 32.768kHz; Frequency Tolerance: 20ppm; Packaging: Tape and Reel; Tolerance: 20ppm; Package Quantity: 3000; Termination: SMD/SMT; Series Resistance: 90kR; Frequency Stability: 20ppm; Length: 2mm; Height: 0.024inch; Width: 1.2mm; Depth: 1.2mm; Radiation Hardening: No; REACH SVHC: No SVHC; Lead Free: Lead Free; ComponentLink1URL: http://www.farnell.com/datasheets/1796520.pdf; ComponentLink1Description: http://www.farnell.com/datasheets/1796520.pdf; ComponentLink2URL: https://abracon.com/Support/PackageDrawing/Resonators/ABS06.PDF; ComponentLink2Description: https://abracon.com/Support/PackageDrawing/Resonators/ABS06.PDF; ComponentLink3URL: http://www.farnell.com/datasheets/1912788.pdf; ComponentLink3Description: http://www.farnell.com/datasheets/1912788.pdf; ComponentLink4URL: http://www.abracon.com/Resonators/ABS06.pdf; ComponentLink4Description: http://www.abracon.com/Resonators/ABS06.pdf